# Altium project FlyControlV5.1.PrjPcb
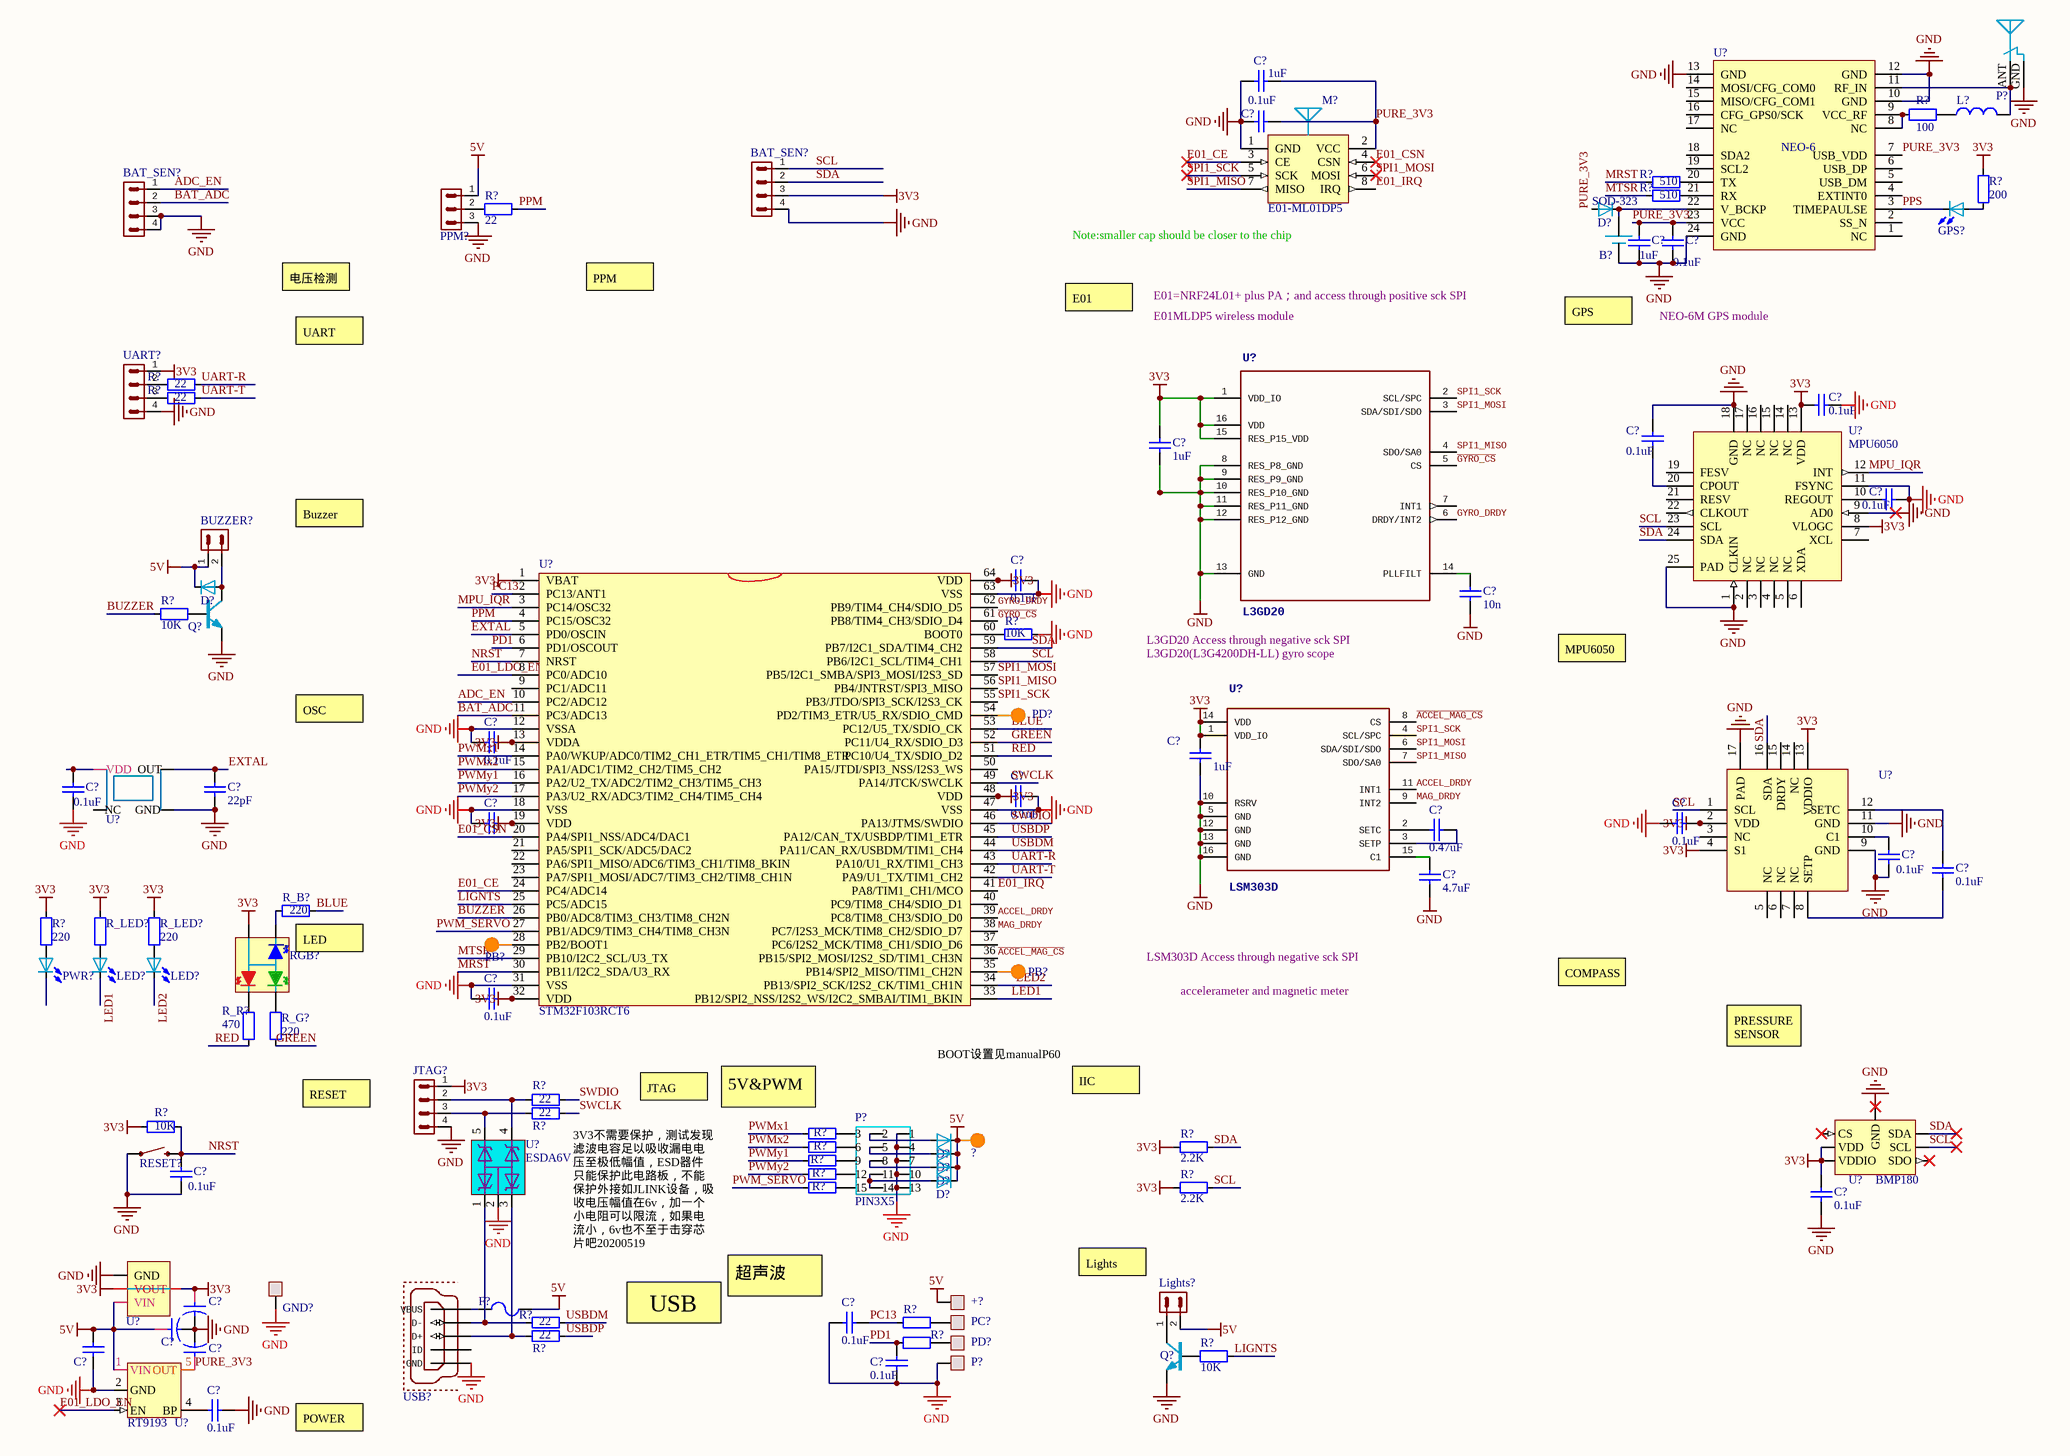
[diagram p0: Sheetv5.1.SchDoc]
1 sheet, 109 parts. Net scope: global (net labels, ports and power ports of the same name join across sheets).

## Sheet Sheetv5.1.SchDoc
size A2

### Parts
(Parts that share a designator on the sheet are numbered #1, #2 ... from top to bottom, then left to right.)
+?  voltage  [PIN1*1]  (value not drawn)
?  voltage  [TEST_P]  (value not drawn)
B?  XH414  [XH414]  (value not drawn)
BAT_SEN?#1  DF13C-4P  [DF13C-4P-1.25V]  (value not drawn)
BAT_SEN?#2  DF13C-4P  [DF13C-4P-1.25V]  (value not drawn)
BUZZER?  DF13C-2P  [DF13C-2P-1.25V]  (value not drawn)
C?#1  1uF  [0805-CAP]
C?#2  0.1uF  [0603-CAP]
C?#3  1uF  [0805-CAP]
C?#4  0.1uF  [0603-CAP]
C?#5  0.1uF  [0603-CAP]
C?#6  0.1uF  [0603-CAP]
C?#7  1uF  [0805-CAP]
C?#8  0.1uF  [0603-CAP]
C?#9  0.1uF  [0603-CAP]
C?#10  10n  [0603-CAP]
C?#11  0.1uF  [0603-CAP]
C?#12  1uF  [0805-CAP]
C?#13  0.1uF  [0603-CAP]
C?#14  0.1uF  [0603-CAP]
C?#15  22pF  [0603-CAP]
C?#16  0.1uF  [0603-CAP]
C?#17  0.1uF  [0603-CAP]  (value not drawn)
C?#18  0.47uF  [0603-CAP]
C?#19  0.1uF  [0603-CAP]
C?#20  0.1uF  [0603-CAP]
C?#21  4.7uF  [0805-CAP]
C?#22  0.1uF  [0603-CAP]
C?#23  0.1uF  [0603-CAP]
C?#24  0.1uF  [0603-CAP]
C?#25  10uF  [TAJ-A(1206)[3216]]  (value not drawn)
C?#26  0.1uF  [0603-CAP]
C?#27  10uF  [TAJ-A(1206)[3216]]  (value not drawn)
C?#28  10uF  [TAJ-A(1206)[3216]]  (value not drawn)
C?#29  0.1uF  [0805-CAP]  (value not drawn)
C?#30  0.1uF  [0603-CAP]
C?#31  0.1uF  [0603-CAP]
D?#1  SOD-323  [SOD-323]
D?#2  shotechy  [SOD-323]  (value not drawn)
D?#3  1N4148  [SOD-523]  (value not drawn)
D?#4  1N4148  [SOD-523]  (value not drawn)
D?#5  1N4148  [SOD-523]  (value not drawn)
D?#6  1N4148  [SOD-523]  (value not drawn)
F?  FUSE  [0805-FUS]  (value not drawn)
GND?  voltage  [PIN1*1]  (value not drawn)
GPS?  LED  [0805-LED]  (value not drawn)
JTAG?  PIN HDR 1x4  [PIN4*1]  (value not drawn)
L?  value  [0805-IND]  (value not drawn)
LED?#1  LED  [0805-LED]  (value not drawn)
LED?#2  LED  [0805-LED]  (value not drawn)
Lights?  DF13C-2P  [DF13C-2P-1.25V]  (value not drawn)
M?  E01-ML01DP5  [E01-ML01DP5 - SMD]
P?#1  IPEX  [IPEX]  (value not drawn)
P?#2  PIN3X5  [PIN HDR3X5]
P?#3  voltage  [PIN1*1]  (value not drawn)
PB?#1  voltage  [TEST_P]  (value not drawn)
PB?#2  voltage  [TEST_P]  (value not drawn)
PC?  voltage  [PIN1*1]  (value not drawn)
PD?#1  voltage  [TEST_P]  (value not drawn)
PD?#2  voltage  [PIN1*1]  (value not drawn)
PPM?  PIN HDR 1X3  [PIN3*1]  (value not drawn)
PWR?  LED  [0805-LED]  (value not drawn)
Q?#1  2N3904  [SOT-23]  (value not drawn)
Q?#2  2N3904  [SOT-23]  (value not drawn)
R?#1  100  [0603-Res]
R?#2  510  [0603-Res]
R?#3  510  [0603-Res]
R?#4  200  [0603-Res]
R?#5  22  [0603-Res]
R?#6  22  [0603-Res]
R?#7  22  [0603-Res]
R?#8  10K  [0603-Res]
R?#9  10K  [0603-Res]
R?#10  220  [0603-Res]
R?#11  22  [0603-Res]
R?#12  22  [0603-Res]
R?#13  10K  [0603-Res]
R?#14  220  [0603-Res]  (value not drawn)
R?#15  220  [0603-Res]  (value not drawn)
R?#16  2.2K  [0603-Res]
R?#17  220  [0603-Res]  (value not drawn)
R?#18  220  [0603-Res]  (value not drawn)
R?#19  220  [0603-Res]  (value not drawn)
R?#20  2.2K  [0603-Res]
R?#21  22  [0603-Res]
R?#22  220  [0603-Res]  (value not drawn)
R?#23  22  [0603-Res]
R?#24  220  [0603-Res]  (value not drawn)
R?#25  10K  [0603-Res]
R_B?  220  [0603-Res]
R_G?  220  [0603-Res]
R_LED?#1  220  [0603-Res]  (value not drawn)
R_LED?#2  220  [0603-Res]
R_R?  470  [0603-Res]
RESET?  KEY_2PIN  [KEY-SMD-2P-1]  (value not drawn)
RGB?  3528LED  [1210-RGBLED]  (value not drawn)
U?#1  NEO-6  [NEO-6]
U?#2  L3GD20  [L3G4200DH-MAN]
U?#3  MPU6050  [QFN-24]
U?#4  STM32F103RCT6  [LQFP-64-S]
U?#5  5032-8M  [XTAL-5032-4P]  (value not drawn)
U?#6  LSM303D  [LGA-16L]
U?#7  HMC5883  [QFN-16-L]  (value not drawn)
U?#8  BMP180  [BMP180-WITHSHELL]
U?#9  ESDA6V1W5(Eb1)  [SOT323-5L]
U?#10  AMS1117-3.3  [SOT-223]  (value not drawn)
U?#11  RT9193  [SOT23-5]
UART?  SH1.0-4P  [SH1.0 S-W-4P]  (value not drawn)
USB?  USB-MICRO  [USB_MICRO]  (value not drawn)

### Nets
3V3: BAT_SEN?#1.3 C?#5.1 C?#7.2 C?#9.2 C?#11.1 C?#12.2 C?#13.2 C?#16.2 C?#17.2 C?#22.1 C?#24.2 C?#25.A JTAG?.1 R?#4.2 R?#10.1 R?#13.1 R?#16.2 R?#20.2 R_LED?#1.1 R_LED?#2.1 RGB?.VCC U?#2.1(VDD_IO) U?#2.15(RES_P15_VDD) U?#2.16(VDD) U?#3.8(VLOGC) U?#3.13(VDD) U?#4.1(VBAT) U?#4.13(VDDA) U?#4.19(VDD) U?#4.32(VDD) U?#4.48(VDD) U?#4.64(VDD) U?#6.1(VDD_IO) U?#6.14(VDD) U?#7.2(VDD) U?#7.4(S1) U?#7.13(VDDIO) U?#8.2(VDD) U?#8.3(VDDIO) U?#10.2(VOUT) U?#10.4(VOUT) UART?.1
5V: +?.1 ?.1 BUZZER?.1 C?#27.A C?#29.2 D?#2.C D?#3.C D?#4.C D?#5.C D?#6.C F?.1 Lights?.2 PPM?.1 U?#10.3(VIN) U?#11.1(VIN)
GND: B?.GND BAT_SEN?#1.4 BAT_SEN?#2.3 BAT_SEN?#2.4 C?#1.2 C?#2.1 C?#3.1 C?#4.1 C?#5.2 C?#6.2 C?#7.1 C?#8.2 C?#9.1 C?#10.1 C?#11.2 C?#12.1 C?#13.1 C?#14.1 C?#15.1 C?#16.1 C?#17.1 C?#19.1 C?#21.1 C?#22.2 C?#23.1 C?#24.1 C?#25.C(K) C?#26.1 C?#27.C(K) C?#28.C(K) C?#29.1 C?#30.1 C?#31.2 GND?.1 JTAG?.4 M?.1(GND) P?#1.GND P?#2.1 P?#2.4 P?#2.7 P?#2.10 P?#2.13 P?#3.1 PPM?.3 Q?#1.1 Q?#2.1 R?#9.1 RESET?.1 U?#1.10(GND) U?#1.12(GND) U?#1.13(GND) U?#1.24(GND) U?#2.8(RES_P8_GND) U?#2.9(RES_P9_GND) U?#2.10(RES_P10_GND) U?#2.11(RES_P11_GND) U?#2.12(RES_P12_GND) U?#2.13(GND) U?#3.1(CLKIN) U?#3.9(AD0) U?#3.11(FSYNC) U?#3.18(GND) U?#3.25(PAD) U?#4.12(VSSA) U?#4.18(VSS) U?#4.31(VSS) U?#4.47(VSS) U?#4.63(VSS) U?#5.2(GND) U?#6.5(GND) U?#6.10(RSRV) U?#6.12(GND) U?#6.13(GND) U?#6.16(GND) U?#7.9(GND) U?#7.11(GND) U?#7.17(PAD) U?#8.7(GND) U?#9.2(GND) U?#10.1(GND) U?#11.2(GND) UART?.4 USB?.GND
~{ACCEL_MAG_CS}: U?#4.36(PB15/SPI2_MOSI/I2S2_SD/TIM1_CH3N) U?#6.8(CS)
ACCEL_DRDY: U?#4.39(PC8/TIM8_CH3/SDIO_D0) U?#6.11(INT1)
ADC_EN: BAT_SEN?#2.1 U?#4.10(PC2/ADC12)
BAT_ADC: BAT_SEN?#2.2 U?#4.11(PC3/ADC13)
BLUE: R_B?.2 U?#4.53(PC12/U5_TX/SDIO_CK)
BUZZER: R?#8.2 U?#4.26(PB0/ADC8/TIM3_CH3/TIM8_CH2N)
E01_CE: M?.3(CE) U?#4.24(PC4/ADC14)
E01_CSN: M?.4(CSN) U?#4.20(PA4/SPI1_NSS/ADC4/DAC1)
E01_IRQ: M?.8(IRQ) U?#4.41(PA8/TIM1_CH1/MCO)
E01_LDO_EN: U?#4.8(PC0/ADC10) U?#11.3(EN)
EXTAL: C?#15.2 U?#4.5(PD0/OSCIN) U?#5.3(OUT)
~{GYRO_CS}: U?#2.5(CS) U?#4.61(PB8/TIM4_CH3/SDIO_D4)
GREEN: R_G?.2 U?#4.52(PC11/U4_RX/SDIO_D3)
GYRO_DRDY: U?#2.6(DRDY/INT2) U?#4.62(PB9/TIM4_CH4/SDIO_D5)
LED1: LED?#1.C U?#4.33(PB12/SPI2_NSS/I2S2_WS/I2C2_SMBAI/TIM1_BKIN)
LED2: LED?#2.C U?#4.34(PB13/SPI2_SCK/I2S2_CK/TIM1_CH1N)
LIGNTS: R?#25.1 U?#4.25(PC5/ADC15)
MAG_DRDY: U?#4.38(PC7/I2S3_MCK/TIM8_CH2/SDIO_D7) U?#6.9(INT2)
MPU_IQR: U?#3.12(INT) U?#4.3(PC14/OSC32)
MRST: R?#2.1 U?#4.30(PB11/I2C2_SDA/U3_RX)
MTSR: R?#3.1 U?#4.29(PB10/I2C2_SCL/U3_TX)
NRST: C?#23.2 R?#13.2 RESET?.2 U?#4.7(NRST)
PC13: C?#26.2 R?#22.1 U?#4.2(PC13/ANT1)
PD1: C?#30.2 R?#24.1 U?#4.6(PD1/OSCOUT)
PPM: R?#5.1 U?#4.4(PC15/OSC32)
PPS: GPS?.C U?#1.3(TIMEPAULSE)
PURE_3V3: C?#1.1 C?#2.2 C?#3.2 C?#4.2 C?#28.A D?#1.A M?.2(VCC) U?#1.7(USB_VDD) U?#1.23(VCC) U?#11.5(OUT)
PWM_SERVO: R?#19.2 U?#4.27(PB1/ADC9/TIM3_CH4/TIM8_CH3N)
PWMx1: R?#14.2 U?#4.14(PA0/WKUP/ADC0/TIM2_CH1_ETR/TIM5_CH1/TIM8_ETR)
PWMx2: R?#15.2 U?#4.15(PA1/ADC1/TIM2_CH2/TIM5_CH2)
PWMy1: R?#17.2 U?#4.16(PA2/U2_TX/ADC2/TIM2_CH3/TIM5_CH3)
PWMy2: R?#18.2 U?#4.17(PA3/U2_RX/ADC3/TIM2_CH4/TIM5_CH4)
RED: R_R?.2 U?#4.51(PC10/U4_TX/SDIO_D2)
SCL: BAT_SEN?#1.1 R?#20.1 U?#3.23(SCL) U?#4.58(PB6/I2C1_SCL/TIM4_CH1) U?#7.1(SCL) U?#8.5(SCL)
SDA: BAT_SEN?#1.2 R?#16.1 U?#3.24(SDA) U?#4.59(PB7/I2C1_SDA/TIM4_CH2) U?#7.16(SDA) U?#8.6(SDA)
SPI1_MISO: M?.7(MISO) U?#2.4(SDO/SA0) U?#4.56(PB4/JNTRST/SPI3_MISO) U?#6.7(SDO/SA0)
SPI1_MOSI: M?.6(MOSI) U?#2.3(SDA/SDI/SDO) U?#4.57(PB5/I2C1_SMBA/SPI3_MOSI/I2S3_SD) U?#6.6(SDA/SDI/SDO)
SPI1_SCK: M?.5(SCK) U?#2.2(SCL/SPC) U?#4.55(PB3/JTDO/SPI3_SCK/I2S3_CK) U?#6.4(SCL/SPC)
SWCLK: R?#12.2 U?#4.49(PA14/JTCK/SWCLK)
SWDIO: R?#11.2 U?#4.46(PA13/JTMS/SWDIO)
UART-R: R?#6.2 U?#4.43(PA10/U1_RX/TIM1_CH3)
UART-T: R?#7.2 U?#4.42(PA9/U1_TX/TIM1_CH2)
USBDM: R?#21.2 U?#4.44(PA11/CAN_RX/USBDM/TIM1_CH4)
USBDP: R?#23.2 U?#4.45(PA12/CAN_TX/USBDP/TIM1_ETR)
NetB?_VCC: B?.VCC D?#1.C U?#1.22(V_BCKP)
NetBUZZER?_2: BUZZER?.2 D?#2.A Q?#1.3
NetC?#6_1: C?#6.1 U?#3.20(CPOUT)
NetC?#8_1: C?#8.1 U?#3.10(REGOUT)
NetC?#10_2: C?#10.2 U?#2.14(PLLFILT)
NetC?#14_2: C?#14.2 U?#5.4(VDD)
NetC?#18_1: C?#18.1 U?#6.3(SETP)
NetC?#18_2: C?#18.2 U?#6.2(SETC)
NetC?#19_2: C?#19.2 U?#7.10(C1)
NetC?#20_1: C?#20.1 U?#7.8(SETP)
NetC?#20_2: C?#20.2 U?#7.12(SETC)
NetC?#21_2: C?#21.2 U?#6.15(C1)
NetC?#31_1: C?#31.1 U?#11.4(BP)
NetD?#3_A: D?#3.A P?#2.2
NetD?#4_A: D?#4.A P?#2.5
NetD?#5_A: D?#5.A P?#2.8
NetD?#6_A: D?#6.A P?#2.11 P?#2.14
NetF?_2: F?.2 USB?.VBUS
NetGPS?_A: GPS?.A R?#4.1
NetJTAG?_2: JTAG?.2 R?#11.1 U?#9.4(D3)
NetJTAG?_3: JTAG?.3 R?#12.1 U?#9.5(D4)
NetL?_1: L?.1 R?#1.2
NetL?_2: L?.2 P?#1.ANT U?#1.11(RF_IN)
NetLED?#1_A: LED?#1.A R_LED?#1.2
NetLED?#2_A: LED?#2.A R_LED?#2.2
NetLights?_1: Lights?.1 Q?#2.3
NetP?#2_3: P?#2.3 R?#14.1
NetP?#2_6: P?#2.6 R?#15.1
NetP?#2_9: P?#2.9 R?#17.1
NetP?#2_12: P?#2.12 R?#18.1
NetP?#2_15: P?#2.15 R?#19.1
NetPB?#1_1: PB?#1.1 U?#4.28(PB2/BOOT1)
NetPB?#2_1: PB?#2.1 U?#4.35(PB14/SPI2_MISO/TIM1_CH2N)
NetPC?_1: PC?.1 R?#22.2
NetPD?#1_1: PD?#1.1 U?#4.54(PD2/TIM3_ETR/U5_RX/SDIO_CMD)
NetPD?#2_1: PD?#2.1 R?#24.2
NetPPM?_2: PPM?.2 R?#5.2
NetPWR?_A: PWR?.A R?#10.2
NetQ?#1_2: Q?#1.2 R?#8.1
NetQ?#2_2: Q?#2.2 R?#25.2
NetR?#1_1: R?#1.1 U?#1.8(NC) U?#1.9(VCC_RF)
NetR?#2_2: R?#2.2 U?#1.20(TX)
NetR?#3_2: R?#3.2 U?#1.21(RX)
NetR?#6_1: R?#6.1 UART?.2
NetR?#7_1: R?#7.1 UART?.3
NetR?#9_2: R?#9.2 U?#4.60(BOOT0)
NetR?#21_1: R?#21.1 U?#9.1(D1) USB?.D-
NetR?#23_1: R?#23.1 U?#9.3(D2) USB?.D+
NetR_B?_1: R_B?.1 RGB?.B
NetR_G?_1: R_G?.1 RGB?.G
NetR_R?_1: R_R?.1 RGB?.R

Not connected (* = marked no-connect by the designer): PWR? C(2); U?#1 1(NC) 2(SS_N) 4(EXTINT0) 5(USB_DM) 6(USB_DP) 14(MOSI/CFG_COM0) 15(MISO/CFG_COM1) 16(CFG_GPS0/SCK) 17(NC) 18(SDA2) 19(SCL2); U?#2 7(INT1); U?#3 2(NC) 3(NC) 4(NC) 5(NC) 6(XDA) 7(XCL) 14(NC) 15(NC) 16(NC) 17(NC) 19(FESV) 21(RESV) 22(CLKOUT); U?#4 9(PC1/ADC11) 21(PA5/SPI1_SCK/ADC5/DAC2) 22(PA6/SPI1_MISO/ADC6/TIM3_CH1/TIM8_BKIN) 23(PA7/SPI1_MOSI/ADC7/TIM3_CH2/TIM8_CH1N) 37(PC6/I2S2_MCK/TIM8_CH1/SDIO_D6) 40(PC9/TIM8_CH4/SDIO_D1) 50(PA15/JTDI/SPI3_NSS/I2S3_WS); U?#5 1(NC); U?#7 3(NC) 5(NC) 6(NC) 7(NC) 14(NC) 15(DRDY); U?#8 1(CS)* 4(SDO)*; USB? ID

### Notes on the sheet
- (near M?) Note:smaller cap should be closer to the chip
- 电压检测
- PPM
- E01
- E01MLDP5 wireless module
- E01=NRF24L01+ plus PA；and access through positive sck SPI
- GPS
- NEO-6M GPS module
- UART
- Buzzer
- L3GD20 Access through negative sck SPI
- OSC
- L3GD20(L3G4200DH-LL) gyro scope
- MPU6050
- LED
- LSM303D Access through negative sck SPI
- accelerameter and magnetic meter
- COMPASS
- PRESSURE SENSOR
- RESET
- JTAG
- (near R?#14) 5V&PWM
- BOOT设置见manualP60
- IIC
- (near R?#12) 3V3不需要保护，测试发现滤波电容足以吸收漏电电压至极低幅值，ESD器件只能保护此电路板，不能保护外接如JLINK设备，吸收电压幅值在6v，加一个小电阻可以限流，如果电流小，6v也不至于击穿芯片吧20200519
- USB
- (near C?#26) 超声波
- Lights
- POWER

### Library data of the parts
+? GND? P?#3 PC? PD?#2 = PIN HDR 1x1
? PB?#1 PB?#2 PD?#1 = TEST: 信号测试点
B? = XH414: XH414贴片法拉电容φ4.7
BAT_SEN?#1 BAT_SEN?#2 = PIN HDR 1x4: 1x4-Pin-connector; LatestRevisionDate: 17-Jul-2002; LatestRevisionNote: Re-released for DXP Platform.; Publisher: Altium Limited
BUZZER? = PIN HDR 1x2: DF13C-2PHeader, 2-Pin; LatestRevisionDate: 17-Jul-2002; LatestRevisionNote: Re-released for DXP Platform.; Publisher: Altium Limited
C?#1 C?#3 C?#7 C?#10 C?#12 C?#15 C?#18 C?#21 = Cap: 无极性Cap; Voltage: 50V; Value: 0.1uF; Published: 8-Jun-2000; LatestRevisionDate: 17-Jul-2002; LatestRevisionNote: Re-released for DXP Platform.; PackageReference: RAD-0.3; Publisher: Altium Limited; PackageDescription: Radial Cap, Thru-Hole; 2 Leads; 0.3 in Pin Spacing; Footprint: 0603
C?#2 C?#4-C?#6 C?#8 C?#9 C?#11 C?#13 C?#14 C?#16 C?#17 C?#19 C?#20 C?#22-C?#24 C?#26 C?#29-C?#31 = Cap: 无极性Cap; Voltage: 50V; Published: 8-Jun-2000; LatestRevisionDate: 17-Jul-2002; LatestRevisionNote: Re-released for DXP Platform.; PackageReference: RAD-0.3; Publisher: Altium Limited; PackageDescription: Radial Cap, Thru-Hole; 2 Leads; 0.3 in Pin Spacing; Footprint: 0603; Value: 0.1uF
C?#25 C?#27 C?#28 = Cap_p: 有极性Cap
D?#1-D?#6 = DIODE
F? = FUSE: 熔断器
JTAG? = PIN HDR 1x4: 1x4-Pin-connector-JTAG; LatestRevisionDate: 17-Jul-2002; LatestRevisionNote: Re-released for DXP Platform.; Publisher: Altium Limited
L? = Inductor: 电感
Lights? = PIN HDR 1x2: Header, 2-Pin; LatestRevisionDate: 17-Jul-2002; LatestRevisionNote: Re-released for DXP Platform.; Publisher: Altium Limited
M? = E01-ML01DP5: 无线模块E01-ML01DP5
P?#1 = IPEX: IPEX天线座
P?#2 = PIN HDR3x5
Q?#1 Q?#2 = NPN: NPN三极管
R?#1 R?#4-R?#21 R?#23 R?#25 R_B? R_G? R_LED?#1 R_LED?#2 R_R? = Res: Resistor; Value: 1K; Published: 8-Jun-2000; LatestRevisionDate: 17-Jul-2002; LatestRevisionNote: Re-released for DXP Platform.; PackageReference: AXIAL-0.4; Publisher: Altium Limited; Footprint: 0603
R?#2 R?#3 R?#22 R?#24 = RES: Resistor; Value: 1K; Published: 8-Jun-2000; LatestRevisionDate: 17-Jul-2002; LatestRevisionNote: Re-released for DXP Platform.; PackageReference: AXIAL-0.4; Publisher: Altium Limited
RGB? = LED-RGB-4PIN
U?#1 = NEO-6: GPS
U?#2 = L3G4200DH-LL: <h3>L3G4200DH - Digital 3-axis Gyroscope</h3> / The L3G4200DH is a low-power three-axis / angular rate sensor. The L3G4200DH has a full scale of ±250/±500/ / ±2000 dps and is capable of measuring rates with / a user-selectable bandwidth. It can operate within a / temperature range from -40 °C to +85 °C. Supply voltage: 2.4 V to 3.6 V. Full datasheet:<br /><br /> / <a href="http://www.st.com/stonline/products/literature/ds/17300.pdf">L3G4200DH Datasheet</a>; PARTNO: L3GD20
U?#3 = MPU6050: dscrps三轴陀螺仪加速度计
U?#5 = XTAL-5032-4P: 4PIN-5032晶振
U?#6 = LSM303D: <b>LSM303D Ultra compact high performance e-compass: 3D accelerometer and 3D magnetometer module</b>; DATASHEET: http://www.st.com/internet/com/TECHNICAL_RESOURCES/TECHNICAL_LITERATURE/DATASHEET/DM00057547.pdf; LINK: http://www.st.com/internet/analog/product/253884.jsp; MFGPN: LSM303D; PARTNO: LSM303D
U?#7 = HMC5883: 地磁计
U?#8 = BMP180: Special BOSCH pressure sensor
U?#9 = ESDA6V1W5(Eb1): ESD protection
U?#10 = AMS1117
UART? = PIN HDR 1x4: SH1.0-4P 1x4-Pin-connector; LatestRevisionDate: 17-Jul-2002; LatestRevisionNote: Re-released for DXP Platform.; Publisher: Altium Limited
USB? = USB